# Altium schematic sheet ADC Driver.SchDoc
size A; SheetNumber: 4; SheetTotal: 4
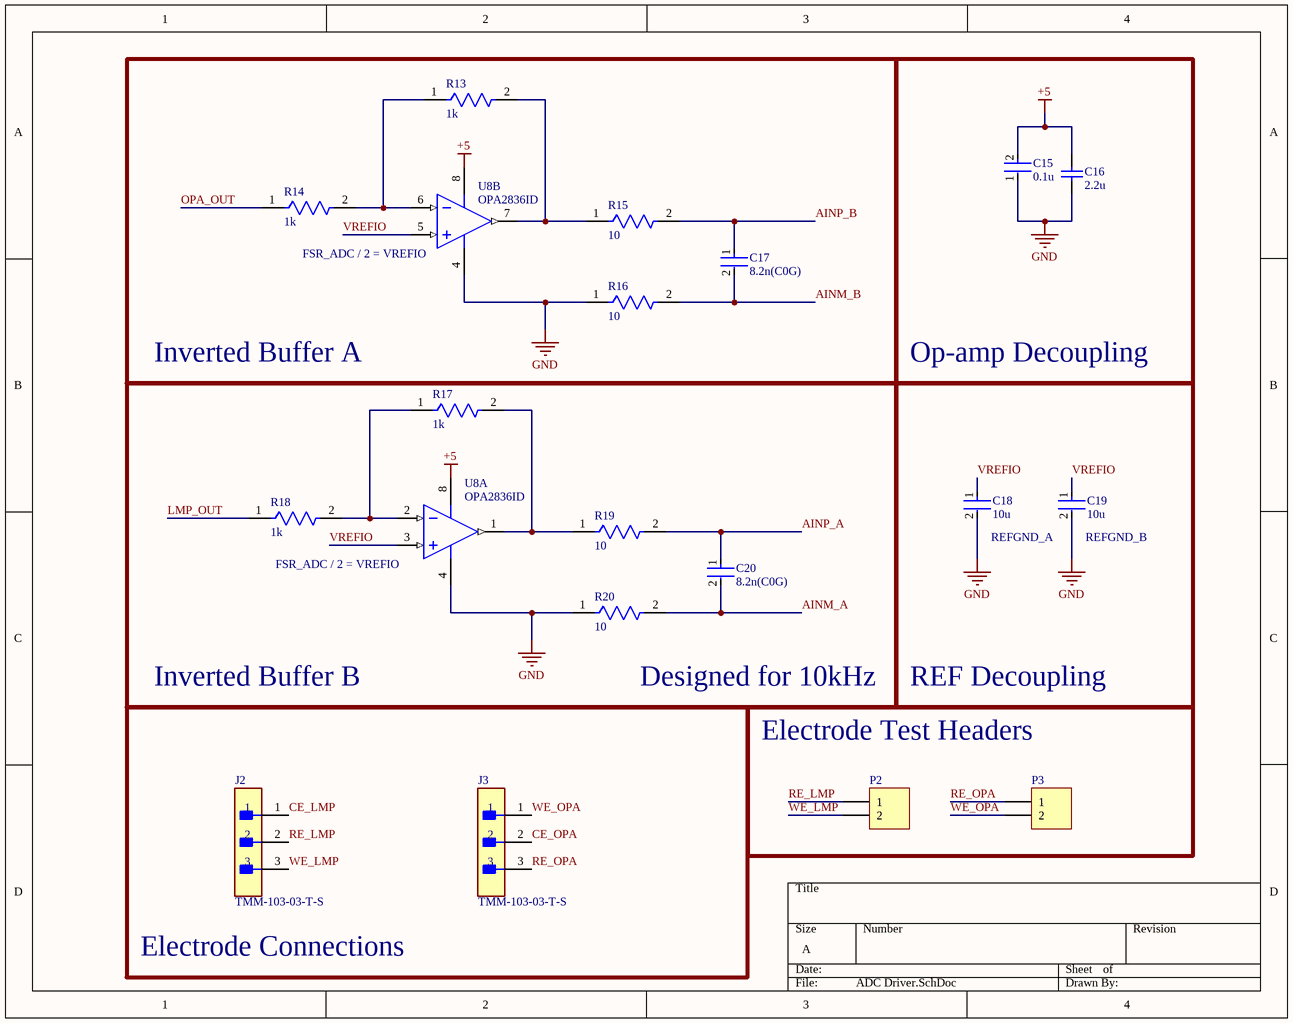
[diagram p0: ADC Driver.SchDoc]

## Parts
C15  0.1u  [FP-GCJ188-0_2-IPC_C]
C16  2.2u  [CAPC0603(1608)100_N]
C17  8.2n(C0G)  [FP-C2012-125-0_2-MFG]
C18  10u  [FP-CL21-IPC_C]
C19  10u  [FP-CL21-IPC_C]
C20  8.2n(C0G)  [FP-C2012-125-0_2-MFG]
J2  TMM-103-03-T-S  [FP-TMM-103-03-T-S-MFG]
J3  TMM-103-03-T-S  [FP-TMM-103-03-T-S-MFG]
P2  Header 2  [My_1X02]  (value not drawn)
P3  Header 2  [My_1X02]  (value not drawn)
R13  1k  [FP-RT0603-MFG]
R14  1k  [FP-RT0603-MFG]
R15  10  [FP-CPF0603-MFG]
R16  10  [FP-CPF0603-MFG]
R17  1k  [FP-RT0603-MFG]
R18  1k  [FP-RT0603-MFG]
R19  10  [FP-CPF0603-MFG]
R20  10  [FP-CPF0603-MFG]
U8  OPA2836ID  [D0008A_L]  (parts A,B of 2)

## Blocks framed on the sheet
Inverted Buffer A: C17 R13-R16 U8
Op-amp Decoupling: C15 C16
REF Decoupling: C18 C19

## Nets
+5: C15.2 C16.2 U8.8(VS+)
GND: C15.1 C16.1 C18.2 C19.2 R16.1 R20.1 U8.4(VS-)
AINM_A: C20.2 R20.2
AINM_B: C17.2 R16.2
AINP_A: C20.1 R19.2
AINP_B: C17.1 R15.2
CE_LMP: J2.1
CE_OPA: J3.2
LMP_OUT: R18.1
OPA_OUT: R14.1
RE_LMP: J2.2 P2.1
RE_OPA: J3.3 P3.1
VREFIO: C18.1 C19.1 U8.3(VIN1+) U8.5(VIN2+)
WE_LMP: J2.3 P2.2
WE_OPA: J3.1 P3.2
NetR13_1: R13.1 R14.2 U8.6(VIN2-)
NetR13_2: R13.2 R15.1 U8.7(VOUT2)
NetR17_1: R17.1 R18.2 U8.2(VIN1-)
NetR17_2: R17.2 R19.1 U8.1(VOUT1)

## Notes on the sheet
- (near U8) FSR_ADC / 2 = VREFIO
- FSR_ADC / 2 = VREFIO
- REFGND_A
- (near C19) REFGND_B
- Inverted Buffer B
- (near R20) Designed for 10kHz
- Electrode Test Headers
- Electrode Connections

## Library data of the parts
C15 = CMP-2006-02223-2: Cap Ceramic 0.1uF 50V X7R 10% Pad SMD 0603 Soft Termination +125°C Automotive T/R; Capacitance: 100nF; Radiation Hardening: No; Dielectric: X7R; Voltage Rating (DC): 50V; Case Code (Imperial): 0603; Length: 1.6mm; Features: Soft Termination; Case Code (Metric): 1608; Case/Package: 0603; Termination: SMD/SMT; Packaging: Tape and Reel; Height: 0.8mm; Tolerance: 10%; Thickness: 0.035inch; Width: 0.031inch; Voltage Rating: 50V; Min Operating Temperature: -55°C; Ratings: AEC-Q200; Package Quantity: 1; Depth: 0.8mm; Mount: Surface Mount; Lead Free: Lead Free; Max Operating Temperature: 125°C
C16 = CMP-1035-02766-1: CAP 2.2uF 16V -20% to +80% 0603 (1608 Metric) Thickness 1mm SMD; Case-Metric: 1608; Case-EIA: 0603; Value: 2.2uF; Rated Voltage: 16 V; Tolerance: -20% to +80%; Technology: SMT; Max Thickness: 1 mm
C17 C20 = CMP-08246-005878-1: Multilayer Ceramic Capacitors 8.2nF ±5% 250V C0G SMD 0805; Mount: Surface Mount; RoHS Compliant: Yes; Dielectric: C0G; Height: 1.25mm; Thickness: 0.057inch; Tolerance: 5%; Voltage Rating (DC): 250V; Width: 0.049inch; Packaging: Tape and Reel; Capacitance: 8.2nF; Max Operating Temperature: 125°C; Weight: 0.000194oz; Length: 0.079inch; Case Code (Imperial): 0805; Voltage Rating: 250V; Case/Package: 0805; Case Code (Metric): 2012; Min Operating Temperature: -55°C; Package Quantity: 2000; Termination: SMD/SMT
C18 C19 = CMP-13271-001427-1: CL21 Series 0805 10uF 6.3V ±10% Tolerance X7R Multilayer Ceramic Chip Capacitor; Min Operating Temperature: -55°C; Capacitance: 10uF; Dielectric: X7R; Voltage Rating: 6.3V; Case/Package: 0805; Height: 1.25mm; Case Code (Metric): 2012; Tolerance: 10%; Packaging: Tape and Reel; Thickness: 0.055inch; Voltage: 6.3V; Max Operating Temperature: 125°C; Lead Free: Lead Free; Package Quantity: 3000; Case Code (Imperial): 0805; Depth: 1.25mm; Width: 0.049inch; Length: 2mm; Mount: Surface Mount
J2 J3 = CMP-02766-001695-1: CONN HEADER VERT 3POS 2MM; Gender: Male; Number of Positions: 3; Max Current Rating: 3.9A; Max Voltage Rating (AC): 500V; Packaging: Bulk; RoHS Compliant: Yes; Mount: Through Hole; Length: 6mm; Contact Type: Male Pin; Package Quantity: 1; Depth: 1.97mm; Contact Material: Bronze; Insulation Material: Polymer; Series: TMM; Contact Plating: Tin; Fastening Type: Pull; Housing Color: Black; Pitch: 2mm; Termination: Solder; Contact Mating Length: 0.157inch; Min Operating Temperature: -55°C; REACH SVHC: No SVHC; Orientation: Straight; Number of Rows: 1; Color: Black; Insulation Color: Black; Connector Type: Header; Radiation Hardening: No; Number of Contacts: 3; Lead Free: Lead Free; Contact Finish - Mating: TIN; Max Operating Temperature: 105°C; Housing Material: Polymer; Contact Shape: Square
P2 P3 = Header 2: Header, 2-Pin; ASiD Part Number: Header 2-AS
R13 R14 R17 R18 = CMP-03412-013082-1: RES SMD 1K OHM 0.1% 1/10W 0603; Manufacturer Part Number: RT0603BRD071KL; Manufacturer: Yageo; Voltage Rating: 75V; Temperature Coefficient: 25ppm/°C; Value: 1kΩ; Power Rating: 0.1W; Temperature Range Low: -55°C; Series: RT; Digikey Description: RES SMD 1K OHM 0.1% 1/10W 0603; Tolerance: 0.1%; Category: Res; RoHS: TRUE; Composition: Thin Film; ComponentLink2Description: Datasheet; Footprint Url: https://www.yageo.com/upload/website/yageo_PYu-R_Mount_10_19050818_343.pdf; Temperature: -55°C to +155°C; ComponentLink2URL: https://www.yageo.com/upload/media/product/productsearch/datasheet/rchip/PYu-RT_1-to-0.01_RoHS_L_11.pdf; Automotive: No; Octopart: https://octopart.com/rt0603brd071kl-yageo-1433776; Device Class L1: Passive Components; Device Class L2: Resistors; Temperature Range High: +155°C; Height: 0.55mm; Device Class L3: Chip SMD Resistors; Lead Free: Yes; Resistance: 1kΩ; Package: RT0603
R15 R16 R19 R20 = CMP-03211-005347-1: RES SMD 10Ω 0.1% 1/16W 0603; Manufacturer: TE Connectivity; Manufacturer Part Number: CPF0603B10RE; Temperature Coefficient: 25ppm/°C; Voltage Rating: 50V; Power Rating: 0.063W; Device Class L2: Resistors; ComponentLink2Description: Datasheet; Temperature Range High: +155°C; Category: Res; Lead Free: Yes; RoHS: TRUE; Package: CPF0603; Automotive: No; Height: 0.55mm; ComponentLink2URL: https://www.te.com/commerce/DocumentDelivery/DDEController?Action=showdoc&DocId=Data+Sheet%7F1773200%7FM%7Fpdf%7FEnglish%7FENG_DS_1773200_M.pdf%7F3-1676481-2; Temperature: -55°C to +155°C; Octopart: https://octopart.com/cpf0603b10re-te+connectivity-22738715; Series: CPF; packaging: 5k Reel; Resistance: 10Ω; octopart_url: https://octopart.com/cpf0603b10re-te+connectivity-22738715; Tolerance: 0.1%; Composition: Thin Film; Value: 10Ω; Temperature Range Low: -55°C; Device Class L1: Passive Components; Device Class L3: Chip SMD Resistors; Ipc Land Pattern Name: RESC15580X45
U8 = CMP-0016-00050-2: Dual, Very Low Power, Rail to Rail Out, Negative Rail In, VFB Operational Amplifier, 2.5 to 5.5 V, -40 to 85 degC, 8-pin SOIC (D8), Green (RoHS & no Sb/Br); Manufacturer: Texas Instruments; Vs(Max)(V): 5.5; Io(Typ)(mA): 50; BW @ Acl(MHz): 205; Vs(Min)(V): 2.5; Iq per channel(Max)(mA): 1; Iib(Max)(nA): 1000; Vn at Flatband(Typ)(nV/rtHz): 4.6; Sub Family: High Output Current Amplifier (>=50mA), High Speed Amplifier (>=50MHz), Low Noise Amp (<=10nV/rtHz), Low Offset Voltage Amplifier (<=500uV), Low Supply Voltage Amplifier (<=2.7V); Vio(Max)(mV): 0.4; 3rd Harmonic(dBc): 105; Settling Time (0.1%)(Typ)(ns): 30; 2nd Harmonic(dBc): 85; Slew Rate(Typ)(V/us): 560; Number of Channels: 2; Mounting Technology: Surface Mount; ComponentLink1URL: http://www.ti.com/; PartNumber: OPA2836ID; ComponentLink1Description: Manufacturer URL; ComponentLink3URL: http://www.ti.com/litv/pdf/msoi002j; PackageVersion: 4040047-3/M, 06/2011; DatasheetVersion: SLOS712D; Acl, min stable gain(V/V): 1; Code_JEDEC: MS-012; ComponentLink2URL: http://www.ti.com/general/docs/lit/getliterature.tsp?genericPartNumber=OPA2836&fileType=pdf; PackageReference: D0008A; ComponentLink3Description: Package Specification; ComponentLink2Description: Datasheet; Eco-Plan: Green (RoHS & no Sb/Br); PackageDescription: 8-Pin Plastic Small Outline, Body 4.9 x 3.9 mm, Pitch 1.27 mm